# Altium schematic sheet Chanel.SchDoc: Котроллер сигналов
size 420 x 297 mm; ApprovedBy: Чуриков; Author: Писукнов; CompanyName: АО НПП "ИТЭЛ"; DocumentNumber: НЛТВ.411183.002; SheetNumber: 1; SheetTotal: 1; GOST_tip_4erteja: Схема электрическая принципиальная
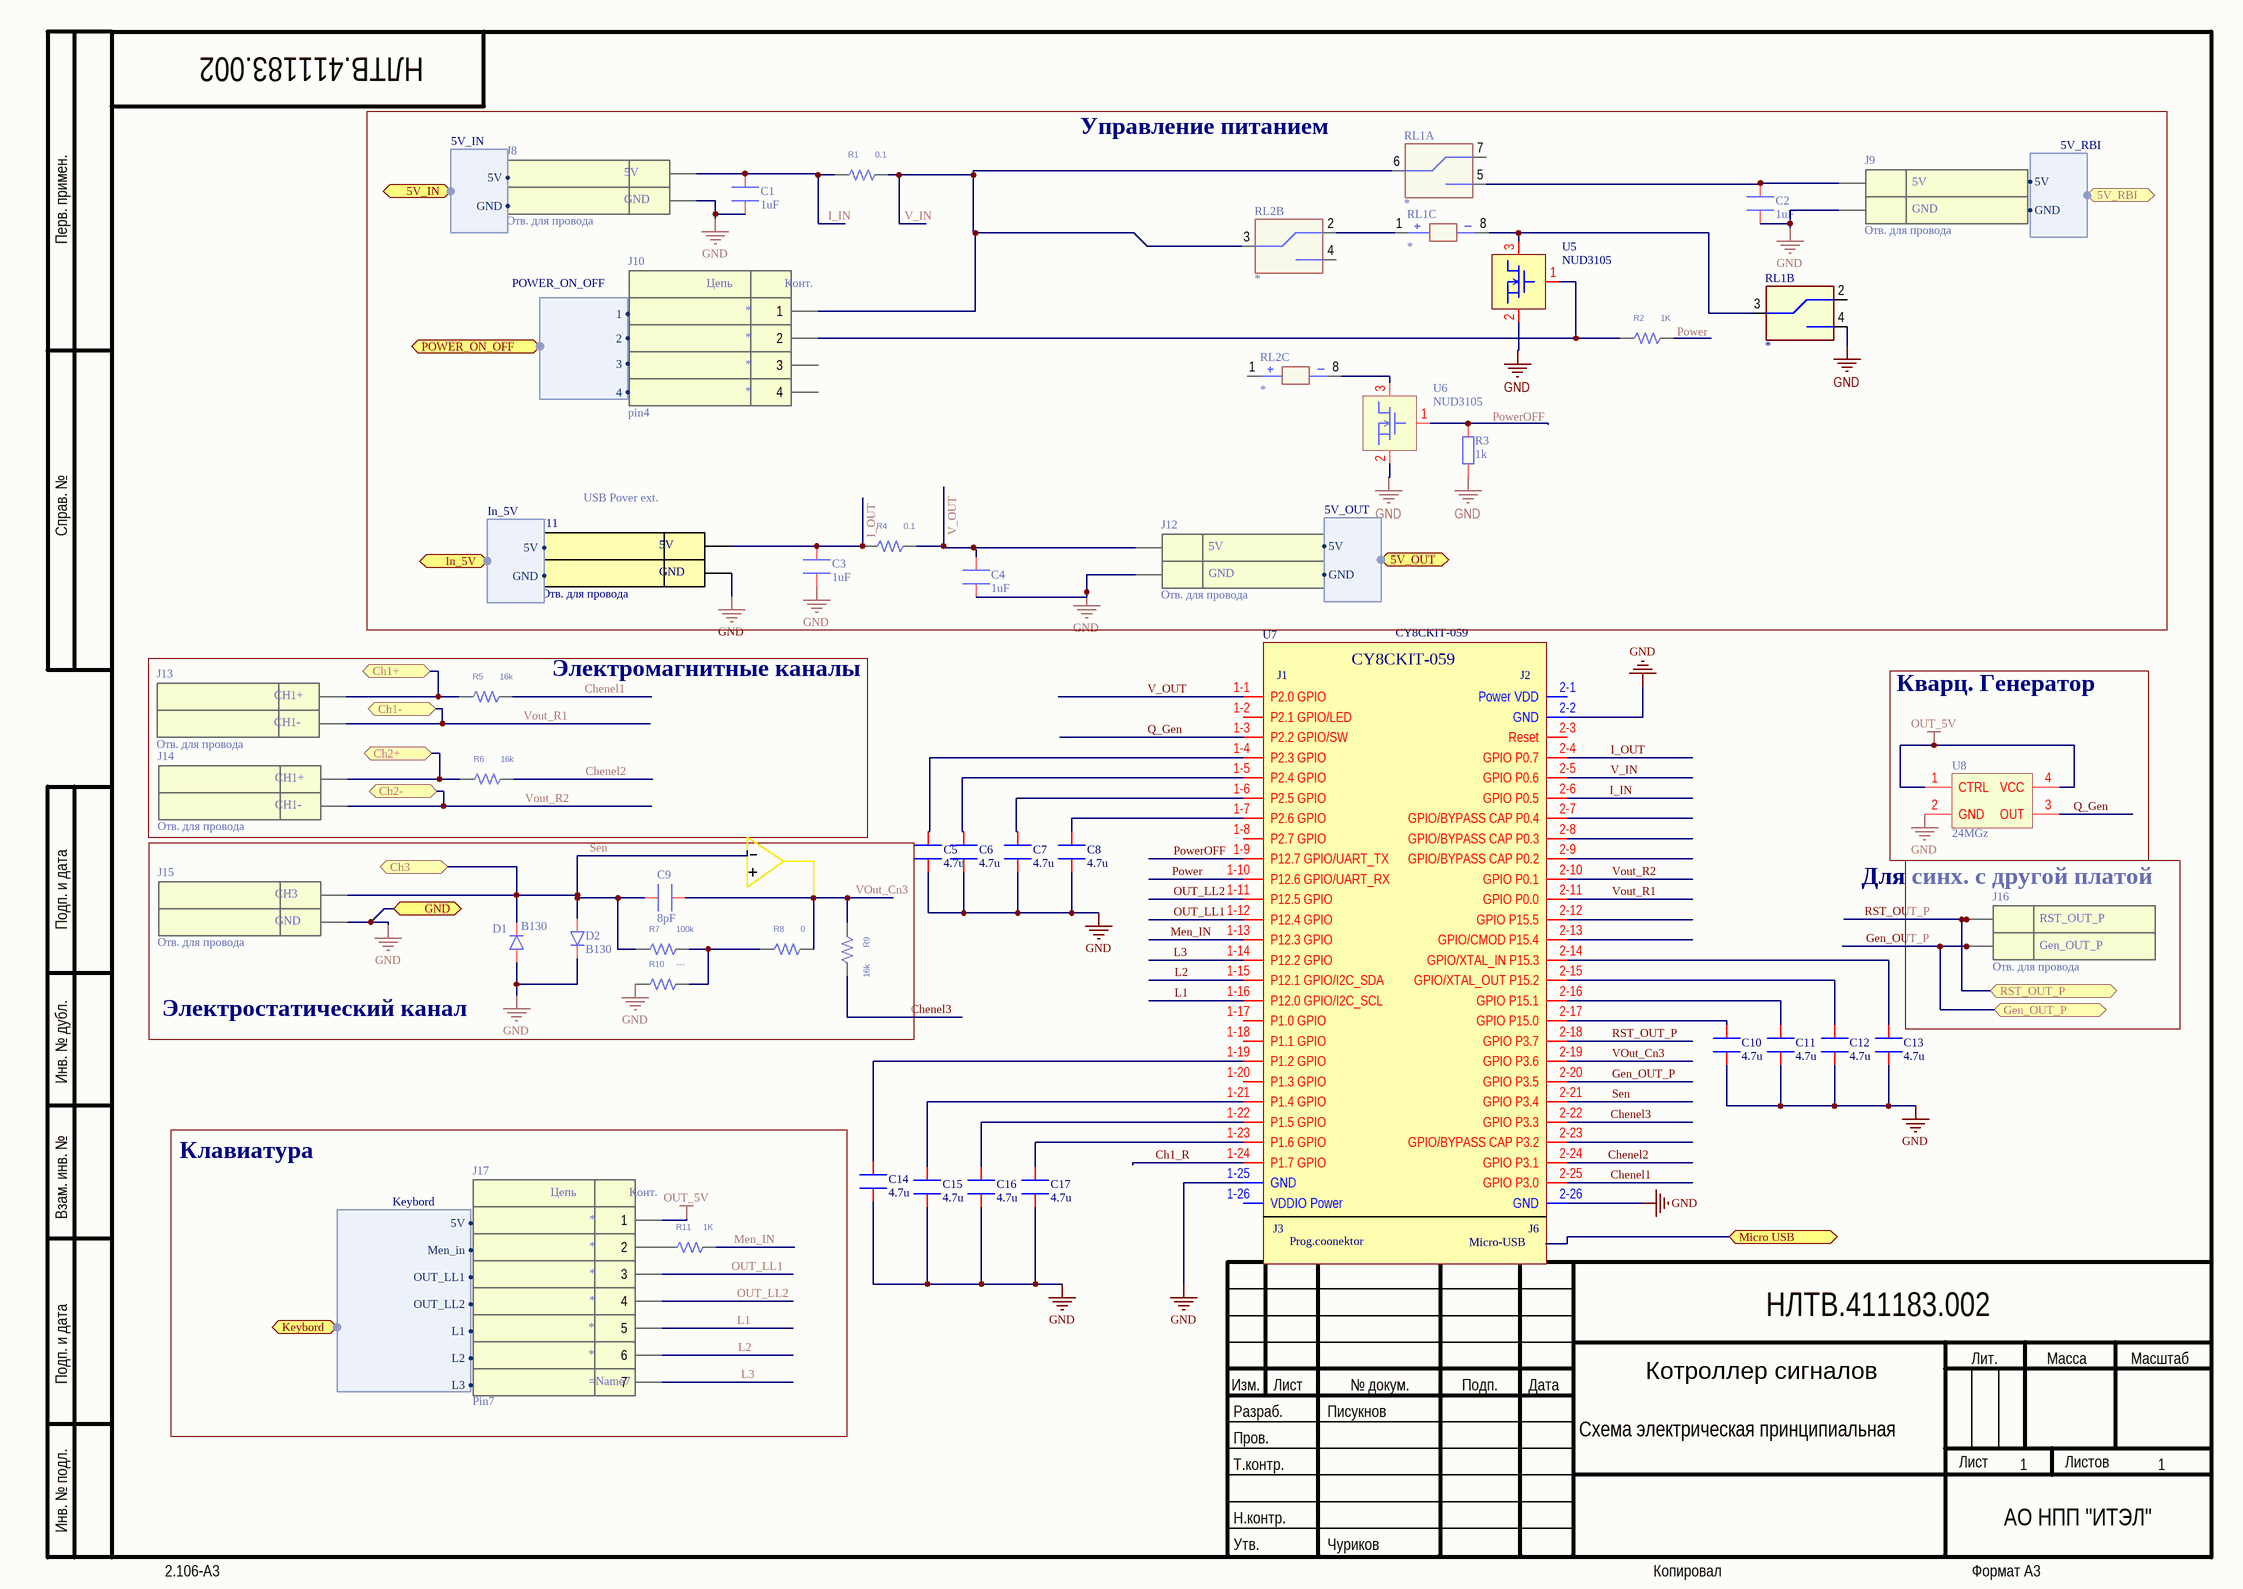
[diagram p0: Chanel.SchDoc]

## Parts
C1  1uF  [SMD0603]
C2  1uF  [SMD0603]
C3  1uF  [SMD0603]
C4  1uF  [SMD0603]
C5  4.7u  [SMD0805]
C6  4.7u  [SMD0805]
C7  4.7u  [SMD0805]
C8  4.7u  [SMD0805]
C9  8pF  [SMD0805]
C10  4.7u  [SMD0805]
C11  4.7u  [SMD0805]
C12  4.7u  [SMD0805]
C13  4.7u  [SMD0805]
C14  4.7u  [SMD0805]
C15  4.7u  [SMD0805]
C16  4.7u  [SMD0805]
C17  4.7u  [SMD0805]
D1  B130  [SMA DIOD]
D2  B130  [SMA DIOD]
J8  Отв. для провода  [JAMPER 2]
J9  Отв. для провода  [JAMPER 2]
J10  pin4  [MF-4MA]
J11  Отв. для провода  [JAMPER 2]
J12  Отв. для провода  [JAMPER 2]
J13  Отв. для провода  [JAMPER 2]
J14  Отв. для провода  [JAMPER 2]
J15  Отв. для провода  [JAMPER 2]
J16  Отв. для провода  [JAMPER 2]
J17  Pin7  [ECH350V-06P]
R1  0.1  [SMD1206]
R2  1K  [SMD1206]
R3  1k  [SMD0805]
R4  0.1  [SMD1206]
R5  16k  [SMD1206]
R6  16k  [SMD1206]
R7  100k  [SMD1206]
R8  0  [SMD1206]
R9  16k  [SMD1206]
R10  ---  [SMD1206]
R11  1K  [SMD1206]
RL1  *  [IM06GR]  (parts A,B,C of 3)
RL2  *  [IM06GR]  (parts B,C of 3)
U5  NUD3105  [SOT-23]
U6  NUD3105  [SOT-23]
U7  CY8CKIT-059  [CY8CKIT-059]
U8  24MGz

## Blocks framed on the sheet
Управление питанием: C1-C4 J8-J12 R1-R4 RL1 RL2 U5 U6
Электромагнитные каналы: J13 J14 R5 R6
Кварц. Генератор: U8
Электростатический канал: C9 D1 D2 J15 R7-R10
Клавиатура: J17 R11

## Ports
5V_IN (harness 5V_IN), 5V_OUT (harness 5V_OUT), 5V_RBI (harness 5V_RBI), Ch1+, Ch1-, Ch2+, Ch2-, Ch3, Gen_OUT_P, GND, In_5V (harness In_5V), Keybord (harness Keybord), Micro USB (bidir), POWER_ON_OFF (harness POWER_ON_OFF), RST_OUT_P

## Harnesses
Keybord: 5V, Men_in, OUT_LL1, OUT_LL2, L1, L2, L3
POWER_ON_OFF: 1, 2, 3, 4
5V_RBI: 5V, GND
5V_IN: 5V, GND
In_5V: 5V, GND
5V_OUT: 5V, GND

## Nets
GND: C1.1 C2.1 C3.1 C4.1 C5.1 C6.1 C7.1 C8.1 C10.1 C11.1 C12.1 C13.1 C14.1 C15.1 C16.1 C17.1 D1.A D2.K J8.2 J9.2 J11.2 J12.2 J15.2 R3.1 R10.1 RL1.4(A14) U5.2(S) U6.2(S) U7.1-25(GND) U7.2-2(GND) U7.2-26(GND) U8.2(GND) ; port GND
OUT_5V: J17.1 U8.1(CTRL) U8.4(VCC)
Ch1+: J13.1 R5.1 ; port Ch1+
Ch1_R: U7.1-24(P1.7_GPIO)
Ch2+: J14.1 R6.1 ; port Ch2+
Chenel1: R5.2 U7.2-25(GPIO_P3.0)
Chenel2: R6.2 U7.2-24(GPIO_P3.1)
Chenel3: R9.2 U7.2-22(GPIO_P3.3)
Gen_OUT_P: J16.2 U7.2-20(GPIO_P3.5) ; port Gen_OUT_P
I_IN: C1.2 J8.1 R1.1 U7.2-6(GPIO_P0.5)
I_OUT: C3.2 J11.1 R4.1 U7.2-4(GPIO_P0.7)
L1: J17.5 U7.1-16(P12.0_GPIO/I2C_SCL)
L2: J17.6 U7.1-15(P12.1_GPIO/I2C_SDA)
L3: J17.7 U7.1-14(P12.2_GPIO)
Men_IN: R11.2 U7.1-13(P12.3_GPIO)
OUT_LL1: J17.3 U7.1-12(P12.4_GPIO)
OUT_LL2: J17.4 U7.1-11(P12.5_GPIO)
Power: U7.1-10(P12.6_GPIO/UART_RX)
PowerOFF: U7.1-9(P12.7_GPIO/UART_TX)
Q_Gen: U7.1-3(P2.2_GPIO/SW) U8.3(OUT)
RST_OUT_P: J16.1 U7.2-18(GPIO_P3.7) ; port RST_OUT_P
Sen: C9.2 D1.K D2.A J15.1 R7.1 U7.2-21(GPIO_P3.4) ; port Ch3
V_IN: J10.1 R1.2 RL1.6(A9) RL2.3(A12) U7.2-5(GPIO_P0.6)
V_OUT: C4.2 J12.1 R4.2 U7.1-1(P2.0_GPIO)
VOut_Cn3: C9.1 R8.2 R9.1 U7.2-19(GPIO_P3.6)
Vout_R1: J13.2 U7.2-11(GPIO_P0.0) ; port Ch1-
Vout_R2: J14.2 U7.2-10(GPIO_P0.1) ; port Ch2-
NetC2_2: C2.2 J9.1 RL1.5(A11)
NetC5_2: C5.2 U7.1-4(P2.3_GPIO)
NetC6_2: C6.2 U7.1-5(P2.4_GPIO)
NetC7_2: C7.2 U7.1-6(P2.5_GPIO)
NetC8_2: C8.2 U7.1-7(P2.6_GPIO)
NetC10_2: C10.2 U7.2-17(GPIO_P15.0)
NetC11_2: C11.2 U7.2-16(GPIO_P15.1)
NetC12_2: C12.2 U7.2-15(GPIO/XTAL_OUT_P15.2)
NetC13_2: C13.2 U7.2-14(GPIO/XTAL_IN_P15.3)
NetC14_2: C14.2 U7.1-19(P1.2_GPIO)
NetC15_2: C15.2 U7.1-21(P1.4_GPIO)
NetC16_2: C16.2 U7.1-22(P1.5_GPIO)
NetC17_2: C17.2 U7.1-23(P1.6_GPIO)
NetJ10_2: J10.2 R2.1 U5.1(G)
NetJ17_2: J17.2 R11.1
NetR3_2: R3.2 U6.1(G)
NetR7_2: R7.2 R8.1 R10.2
NetRL1_1: RL1.1(+) RL2.2(A13)
NetRL1_3: RL1.3(A12) RL1.8(-) U5.3(D)
NetRL2_8: RL2.8(-) U6.3(D)

Not connected (* = marked no-connect by the designer): J10 3 4; R2 2; RL1 2(A13) 7(A10); RL2 1(+) 4(A14); U7 1-2(P2.1_GPIO/LED) 1-8(P2.7_GPIO) 1-17(P1.0_GPIO) 1-18(P1.1_GPIO) 1-20(P1.3_GPIO) 1-26(VDDIO_Power) 2-1(Power_VDD) 2-3(Reset) 2-7(GPIO/BYPASS_CAP_P0.4) 2-8(GPIO/BYPASS_CAP_P0.3) 2-9(GPIO/BYPASS_CAP_P0.2) 2-12(GPIO_P15.5) 2-13(GPIO/CMOD_P15.4) 2-23(GPIO/BYPASS_CAP_P3.2)

## Notes on the sheet
- USB Pover ext.
- (near J16) Для синх. с другой платой
- Labels drawn without touching a wire or pin: Power, PowerOFF
- Перв. примен.
- Справ. №
- Подп. и дата
- Инв. № дубл.
- Взам. инв. №
- Разраб.
- Изм.
- Лист
- № докум.
- Подп.
- Дата
- Лит.
- Масса
- Масштаб
- Пров.
- Т.контр.
- Листов
- Инв. № подл.
- Утв.
- Н.контр.
- 2.106-A3
- Копировал
- Формат А3
- (in symbol CY8CKIT-059) J1; J2; J3; J6; Prog.coonektor; Micro-USB
- (in symbol pin4) Цепь; Конт.
- (in symbol Pin7) Цепь; Конт.

## Library data of the parts
C1-C8 C10-C17 = CAP
  C1-C4: value: *
  C5-C8 C10-C17: value: 4.7u
C9 = CAP: value: 4.7u
D1 D2 = DIOD: value: *
J8 J9 J11 J12 = pin2_continuation: Name1: 5V; Name2: GND
J13 J14 = pin2_continuation: Name1: CH1+; Name2: CH1-
J15 = pin2_continuation: Name1: CH3; Name2: GND
J16 = pin2_continuation: Name1: RST_OUT_P; Name2: Gen_OUT_P
R1 R2 R4 R7 R10 R11 = R: TC2: 0; POWER: RMAX; MAX_TEMP: RTMAX; SLOPE: RSMAX; VOLTAGE: RVMAX; PSpiceTemplate: R^@REFDES %1 %2 ?TOLERANCE|R^@REFDES| @VALUE TC=@TC1,@TC2 ?TOLERANCE|\n.model R^@REFDES RES R=1 DEV=@TOLERANCE% TC1=@TC1 TC2=@TC2|; DIST: FLAT; Value: 16k; TC1: 0
R3 = RES_SMD: value: 1k
R5 R6 R9 = R: TC2: 0; POWER: RMAX; MAX_TEMP: RTMAX; SLOPE: RSMAX; VOLTAGE: RVMAX; PSpiceTemplate: R^@REFDES %1 %2 ?TOLERANCE|R^@REFDES| @VALUE TC=@TC1,@TC2 ?TOLERANCE|\n.model R^@REFDES RES R=1 DEV=@TOLERANCE% TC1=@TC1 TC2=@TC2|; DIST: FLAT; TC1: 0; Value: 16k
R8 = R: POWER: RMAX; MAX_TEMP: RTMAX; SLOPE: RSMAX; VOLTAGE: RVMAX; PSpiceTemplate: R^@REFDES %1 %2 ?TOLERANCE|R^@REFDES| @VALUE TC=@TC1,@TC2 ?TOLERANCE|\n.model R^@REFDES RES R=1 DEV=@TOLERANCE% TC1=@TC1 TC2=@TC2|; DIST: FLAT; Value: 16k; TC2: 0; TC1: 0
RL1 RL2 = Relay_2 switch: value: *
U8 = KXO-97
J10 = pin4: Name1: *; Name2: *; Name3: *; Name4: *
J17 = Pin7: Name1: *; Name2: *; Name3: *; Name4: *; Name5: *; Name6: *